# Altium schematic sheet vioutchn7.SchDoc: VIOUTCHN1
size A4 portrait; Organization: 合肥弗雷电子; Address1: 玉兰大道14号D栋3楼; Address2: 肥西县桃花镇; Address3: 合肥市; Address4: 安徽省
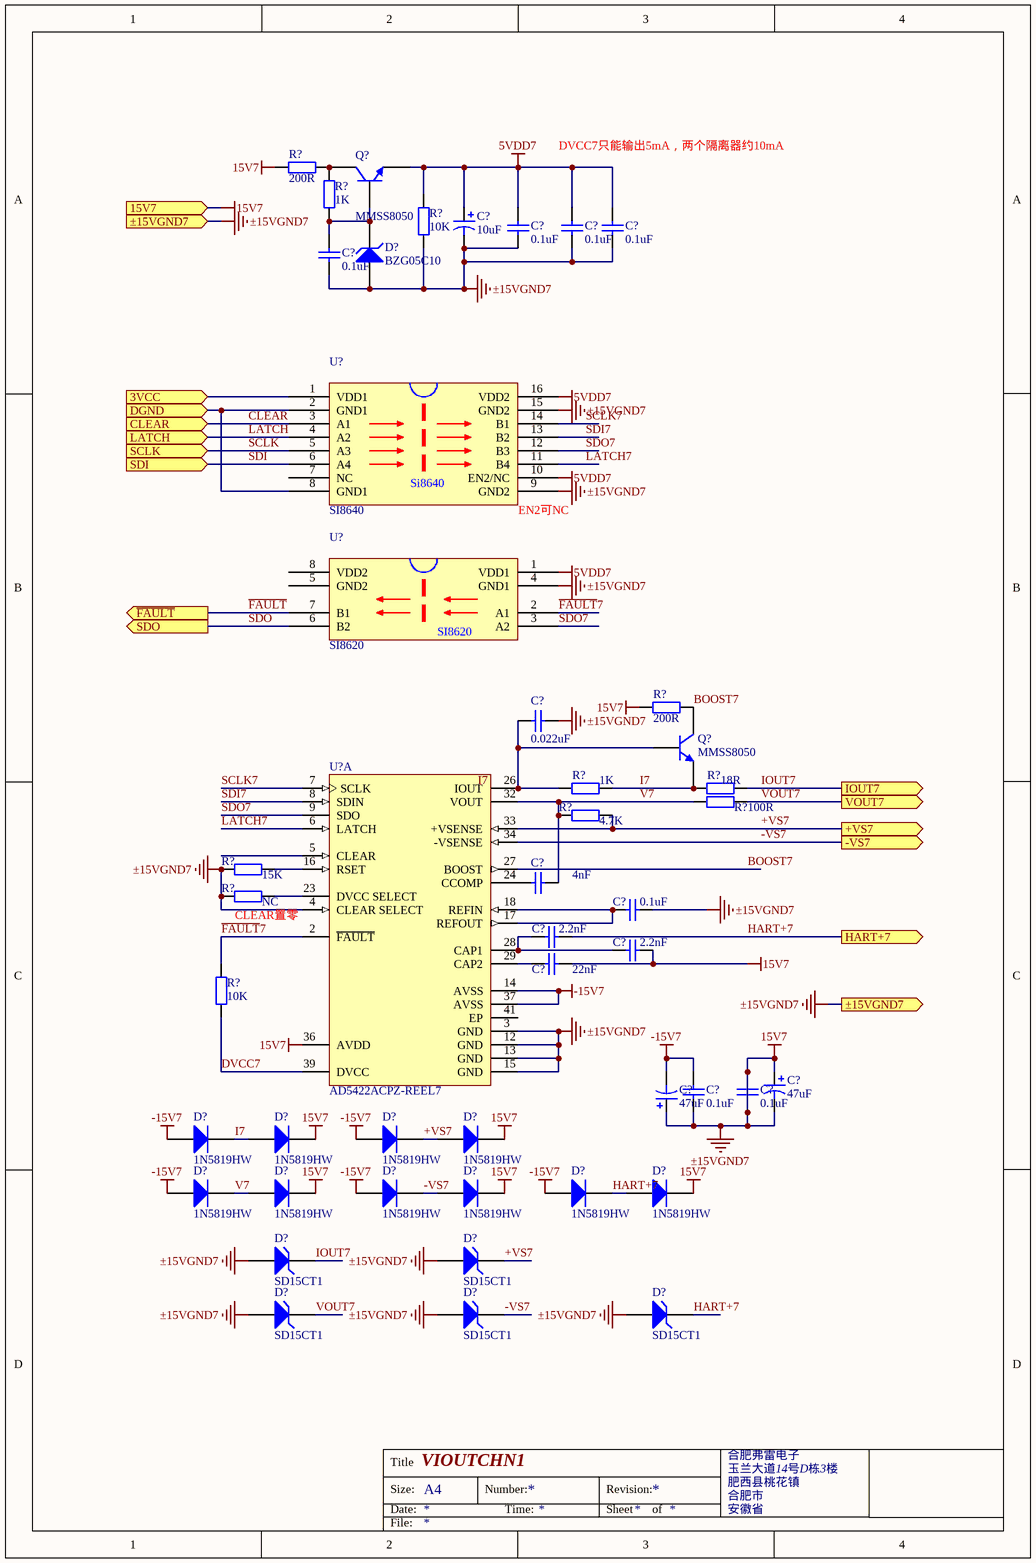
[diagram p0: vioutchn7.SchDoc]

## Parts
(Parts that share a designator on the sheet are numbered #1, #2 ... from top to bottom, then left to right.)
C?#1  value 10uF  [CB]  (hidden comment: T494B106M006AHAUTO)
C?#2  value 0.1uF  [0805c]  (hidden comment: CC0805MRX7R9BB104)
C?#3  value 0.1uF  [0805c]  (hidden comment: CC0805MRX7R9BB104)
C?#4  value 0.1uF  [0805c]  (hidden comment: CC0805MRX7R9BB104)
C?#5  value 0.1uF  [0805c]  (hidden comment: CC0805MRX7R9BB104)
C?#6  value 0.022uF  [0805c]  (hidden comment: CC0805MRX7R9BB103)
C?#7  value 4nF  [0805c]
C?#8  value 0.1uF  [0805c]  (hidden comment: CC0805MRX7R9BB104)
C?#9  value 2.2nF  [0805c]
C?#10  value 2.2nF  [0805c]
C?#11  value 22nF  [0805c]
C?#12  value 0.1uF  [0805c]  (hidden comment: CC0805MRX7R9BB104)
C?#13  value 0.1uF  [0805c]  (hidden comment: CC0805MRX7R9BB104)
C?#14  value 47uF  [CB]  (hidden comment: T494B476K025ATAUTO)
C?#15  value 47uF  [CB]  (hidden comment: T494B476K025ATAUTO)
D?#1  BZG05C10  [DO214]
D?#2  1N5819HW  [sod123]
D?#3  1N5819HW  [sod123]
D?#4  1N5819HW  [sod123]
D?#5  1N5819HW  [sod123]
D?#6  1N5819HW  [sod123]
D?#7  1N5819HW  [sod123]
D?#8  1N5819HW  [sod123]
D?#9  1N5819HW  [sod123]
D?#10  1N5819HW  [sod123]
D?#11  1N5819HW  [sod123]
D?#12  SD15CT1  [sod323]
D?#13  SD15CT1  [sod323]
D?#14  SD15CT1  [sod323]
D?#15  SD15CT1  [sod323]
D?#16  SD15CT1  [sod323]
Q?#1  MMSS8050  [SOT-23-BJT]
Q?#2  MMSS8050  [SOT-23-BJT]
R?#1  value 200R  [0805R]
R?#2  value 1K  [0805R]  (hidden comment: RC0805JR-071KL)
R?#3  value 10K  [0805R]  (hidden comment: RC0805JR-0710KL)
R?#4  value 200R  [0805R]
R?#5  value 1K  [0805R]  (hidden comment: RC0805JR-071KL)
R?#6  value 18R  [0805R]
R?#7  value 100R  [0805R]
R?#8  value 4.7K  [0805R]
R?#9  value 15K  [0805R]  (hidden comment: E192)
R?#10  value NC  [0805R]  (hidden comment: E192)
R?#11  value 10K  [0805R]  (hidden comment: RC0805JR-0710KL)
U?#1  SI8640
U?#2  SI8620
U?#3  AD5422ACPZ-REEL7  [CP-40-1_N]  (part A of 2)

## Ports
3VCC (in), 15V7 (in), +VS7 (out), -VS7 (out), CLEAR (in), DGND (in), HART+7 (out), IOUT7 (out), LATCH (in), SCLK (in), SDI (in), SDO (out), VOUT7 (out), ~{FAULT} (out), ±15VGND7 (in), ±15VGND7 (out)

## Nets
5VDD7: C?#1.1 C?#2.2 C?#3.2 C?#4.2 Q?#1.3(E) R?#3.1 U?#1.10(EN2/NC) U?#1.16(VDD2) U?#2.1(VDD1)
15V7: C?#1.2 C?#2.1 C?#3.1 C?#4.1 C?#5.2 C?#6.1 C?#8.2 C?#10.1 C?#11.1 C?#12.2 C?#13.1 C?#13.2 C?#14.1 C?#14.2 C?#15.1 D?#1.1(A) D?#3.2(K) D?#5.2(K) D?#7.2(K) D?#9.2(K) D?#11.2(K) D?#12.1(A) D?#13.1(A) D?#14.1(A) D?#15.1(A) D?#16.1(A) R?#1.2 R?#3.2 R?#4.2 R?#9.1 R?#10.1 U?#1.9(GND2) U?#1.15(GND2) U?#2.4(GND1) U?#3.3(GND) U?#3.4(CLEAR_SELECT) U?#3.12(GND) U?#3.13(GND) U?#3.15(GND) U?#3.36(AVDD) ; port 15V7, port ±15VGND7  [also labelled ±15VGND7]
-15V7: C?#12.1 C?#15.2 D?#2.1(A) D?#4.1(A) D?#6.1(A) D?#8.1(A) D?#10.1(A) U?#3.14(AVSS) U?#3.37(AVSS)
3VCC: U?#1.1(VDD1) ; port 3VCC
+VS7: D?#4.2(K) D?#5.1(A) D?#13.2(K) R?#8.2 U?#3.33(+VSENSE) ; port +VS7
-VS7: D?#8.2(K) D?#9.1(A) D?#15.2(K) U?#3.34(-VSENSE) ; port -VS7
BOOST7: Q?#2.1(C) R?#4.1 U?#3.27(BOOST)
CLEAR: U?#1.3(A1) ; port CLEAR
DGND: U?#1.2(GND1) U?#1.8(GND1) ; port DGND
DVCC7: R?#11.2 U?#3.39(DVCC)
~{FAULT}: U?#2.7(B1) ; port ~{FAULT}
~{FAULT}7: R?#11.1 U?#2.2(A1) U?#3.2(~{FAULT})
HART+7: C?#9.1 D?#10.2(K) D?#11.1(A) D?#16.2(K) ; port HART+7
I7: D?#2.2(K) D?#3.1(A) Q?#2.3(E) R?#5.2 R?#6.1
IOUT7: D?#12.2(K) R?#6.2 ; port IOUT7
LATCH: U?#1.4(A2) ; port LATCH
LATCH7: U?#1.11(B4) U?#3.6(LATCH)
SCLK: U?#1.5(A3) ; port SCLK
SCLK7: U?#1.14(B1) U?#3.7(SCLK)
SDI: U?#1.6(A4) ; port SDI
SDI7: U?#1.13(B2) U?#3.8(SDIN)
SDO: U?#2.6(B2) ; port SDO
SDO7: U?#1.12(B3) U?#2.3(A2) U?#3.9(SDO)
V7: C?#7.2 D?#6.2(K) D?#7.1(A) R?#7.1 R?#8.1 U?#3.32(VOUT)
VOUT7: D?#14.2(K) R?#7.2 ; port VOUT7
NetC?#5_1: C?#5.1 D?#1.2(K) Q?#1.2(B) R?#2.1
NetC?#6_2: C?#6.2 Q?#2.2(B) R?#5.1 U?#3.26(IOUT)
NetC?#7_1: C?#7.1 U?#3.24(CCOMP)
NetC?#8_1: C?#8.1 U?#3.17(REFOUT) U?#3.18(REFIN)
NetC?#9_2: C?#9.2 C?#10.2 U?#3.28(CAP1)
NetC?#11_2: C?#11.2 U?#3.29(CAP2)
NetQ?#1_1: Q?#1.1(C) R?#1.1 R?#2.2
NetR?#9_2: R?#9.2 U?#3.16(RSET)
NetR?#10_2: R?#10.2 U?#3.23(DVCC_SELECT)

Not connected (* = marked no-connect by the designer): U?#1 7(NC); U?#2 5(GND2) 8(VDD2); U?#3 5(CLEAR) 41(EP)

## Notes on the sheet
- DVCC7只能输出5mA，两个隔离器约10mA
- (near U?#1) EN2可NC
- (near R?#10) CLEAR置零
- Labels drawn without touching a wire or pin: I7
- Title
- Size:
- Date:
- A4
- Number:
- Time:
- Revision:
- Sheet
- of
- File:
- (in symbol SI8640) Si8640

## Library data of the parts
C?#1 C?#14 C?#15 = Cap Pol1: Polarized Capacitor (Radial); Published: 8-Jun-2000; LatestRevisionDate: 17-Jul-2002; LatestRevisionNote: Re-released for DXP Platform.; PackageReference: RB7.6-15; Publisher: Altium Limited; PackageDescription: Polarized Capacitor (Radial); 2 Leads
C?#2-C?#13 = Cap: Capacitor; Published: 8-Jun-2000; LatestRevisionDate: 17-Jul-2002; LatestRevisionNote: Re-released for DXP Platform.; PackageReference: RAD-0.3; Publisher: Altium Limited; PackageDescription: Radial Cap, Thru-Hole; 2 Leads; 0.3 in Pin Spacing
D?#1 = BZG05C10: Silicon Zener Diode (3W); Published: 8-Jun-2000; LatestRevisionDate: 17-Jul-2002; LatestRevisionNote: Re-released for DXP Platform.; DatasheetDocument: 1-Apr-1999; PackageDocument: Apr-1999; PackageReference: DO214; Publisher: Altium Limited; ComponentLink1Description: Manufacturer Link; ComponentLink1URL: http://www.vishay.com/; ComponentLink2Description: Datasheet; ComponentLink2URL: http://www.vishay.com/docs/85595/85595.pdf
D?#2-D?#11 = Diode: Default Diode; Published: 8-Jun-2000; LatestRevisionDate: 17-Jul-2002; LatestRevisionNote: Re-released for DXP Platform.; PackageVersion: Sep-1996; PackageReference: SMC; Publisher: Altium Limited; PackageDescription: DO-214-AB/SMC; 2 C-Bend Leads; Body 7.9 x 5.9 mm, inc. leads (LxW); Code_JEDEC: DO-214-AB
D?#12-D?#16 = D Zener: Zener Diode; Published: 8-Jun-2000; LatestRevisionDate: 17-Jul-2002; LatestRevisionNote: Re-released for DXP Platform.; PackageReference: DIODE-0.7; Publisher: Altium Limited; PackageDescription: Diode, Thru-Hole; 2 Leads; 0.7 in Pin Spacing
Q?#1 Q?#2 = NPN: NPN Bipolar Transistor; Published: 8-Jun-2000; LatestRevisionDate: 17-Jul-2002; LatestRevisionNote: Re-released for DXP Platform.; PackageReference: TO-226-AA; Publisher: Altium Limited; PackageDescription: TO, Flat Index; 3 In-Line, Axial Leads; Body Dia. 4.8mm; Leads 0.55 x 0.51 mm (max); Code_JEDEC: TO-226-AA
R?#1-R?#11 = Res2: Resistor; Published: 8-Jun-2000; LatestRevisionDate: 17-Jul-2002; LatestRevisionNote: Re-released for DXP Platform.; PackageReference: AXIAL-0.4; Publisher: Altium Limited; PackageDescription: Axial Device, Thru-Hole; 2 Leads; 0.4 in Pin Spacing
U?#3 = AD5422ACPZ-REEL7: Single 16-Bit Current Source Digital-to-Analog Converter with Serial Interface and HART Connectivity, -40 to +85 degC, CP-40-1, Pb-Free, Reel; Generic Part Number: AD5422; Manufacturer: Analog Devices; # DAC Outputs: 1; Max V+: 40V; Op Pwr Diss: 158mW; Resolution (Bits): 16; Settling Time: 18祍; Single Supply: No; DatasheetVersion: Rev.E; PackageVersion: Oct-2006; PackageReference: CP-40-1; PackageDescription: 40-Pin Lead Frame Chip Scale Package [LFCSP_VQ] Very Thin Quad; Supplier 1: Digi-Key; Supplier Part Number 1: AD5422ACPZ-REEL7TR-ND; Supplier 2: Digi-Key; Supplier Part Number 2: AD5422ACPZ-REEL7CT-ND; Supplier 3: Digi-Key; Supplier Part Number 3: AD5422ACPZ-REEL7DKR-ND; Supplier 4: Mouser; Supplier Part Number 4: 584-AD5422ACPZ-R7; Packing: Reel; RoHS: Y; Mounting Technology: Surface Mount; Code_JEDEC: MO-220-VJJD-2; PartNumber: AD5422ACPZ-REEL7; ComponentLink1Description: Manufacturer URL; ComponentLink1URL: http://www.analog.com/en/index.html; ComponentLink2Description: Datasheet; ComponentLink2URL: http://www.analog.com/static/imported-files/data_sheets/AD5412_5422.pdf; ComponentLink3Description: Package Specification; ComponentLink3URL: http://www.analog.com/static/imported-files/packages/PKG_PDF/LFCSP(CP)/CP_40_1.pdf; ComponentLink4Description: Product URL; ComponentLink4URL: http://www.analog.com/en/digital-to-analog-converters/da-converters/ad5422/products/product.html; ComponentLink5Description: Reference Design URL; ComponentLink5URL: http://www.analog.com/en/digital-to-analog-converters/da-converters/ad5422/products/product.html#prod_cross_sell